# Altium schematic sheet 4-USB-A.SchDoc
size A4
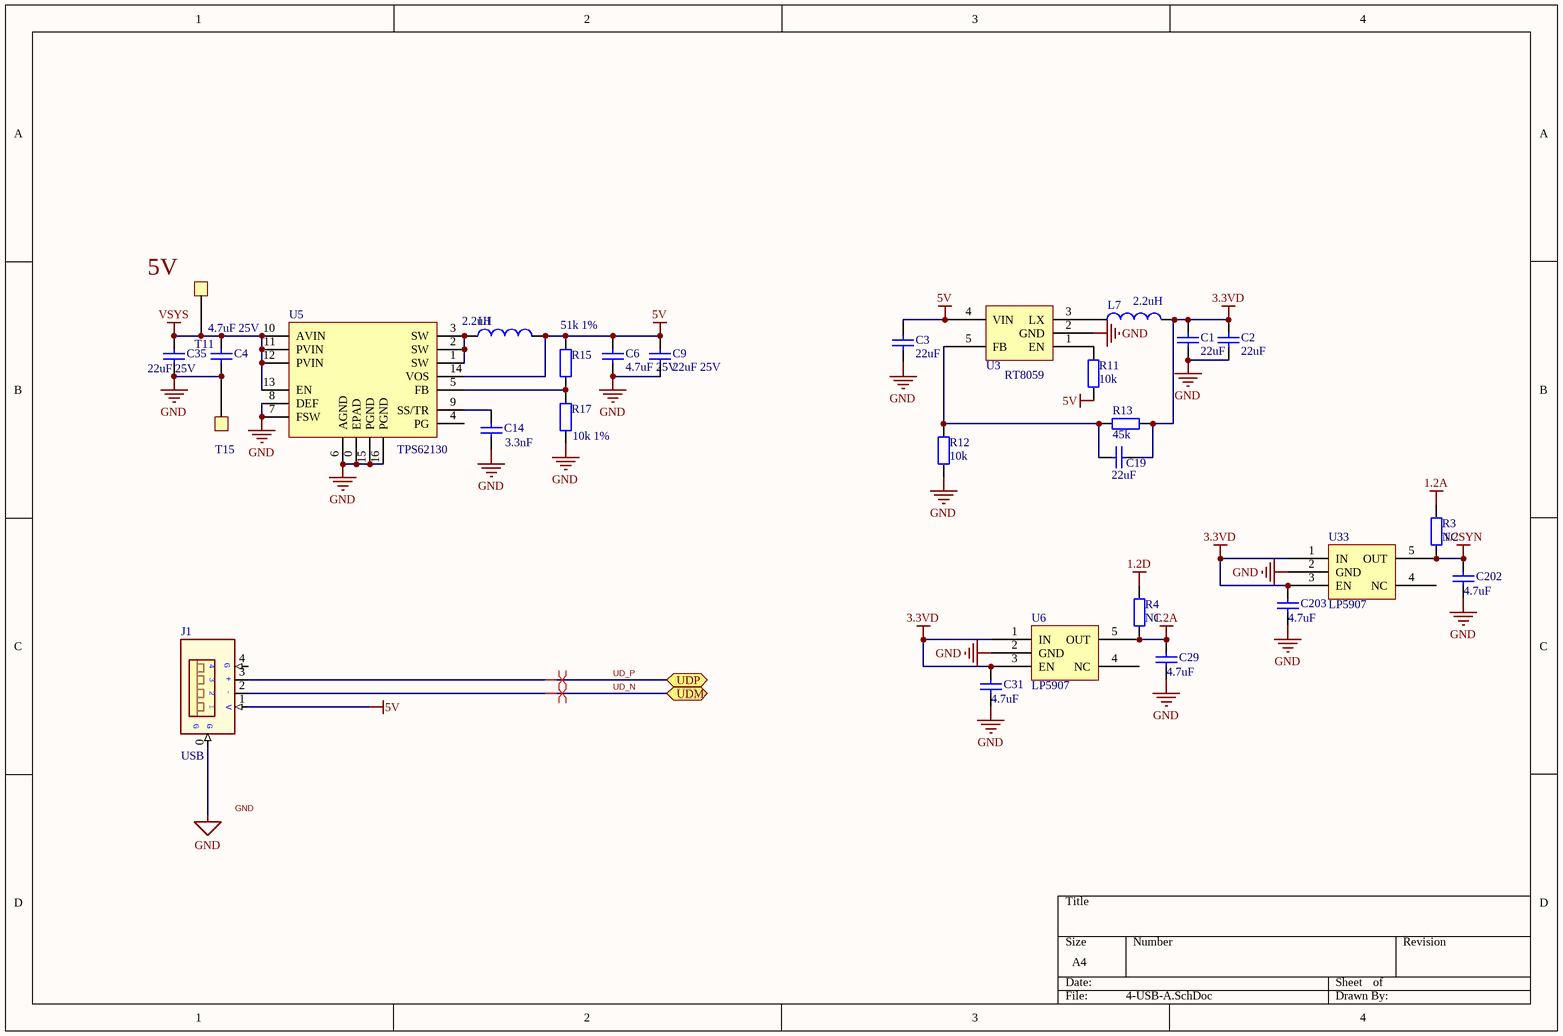
[diagram p0: 4-USB-A.SchDoc]

## Parts
C1  value 22uF  [0805]  (hidden comment: Cap)
C2  value 22uF  [0805]  (hidden comment: Cap)
C3  value 22uF  [0805]  (hidden comment: Cap)
C4  value 4.7uF 25V  [0805]  (hidden comment: Cap)
C6  value 4.7uF 25V  [0805]  (hidden comment: Cap)
C9  value 22uF 25V  [1210]  (hidden comment: Cap)
C14  3.3nF  [0402]
C19  value 22uF  [0402]  (hidden comment: Cap)
C29  4.7uF  [0603]
C31  4.7uF  [0603]
C35  value 22uF 25V  [1210]  (hidden comment: Cap)
C202  4.7uF  [0603]
C203  4.7uF  [0603]
J1  USB  [USB-A-MALE]
L1  2.2uH  [L4015]
L7  2.2uH  [0806]
R3  NC  [0402]
R4  NC  [0402]
R11  10k  [0402]
R12  10k  [0402]
R13  45k  [0402]
R15  51k 1%  [0402]
R17  10k 1%  [0402]
T11  TestPad  [TestPad]  (value not drawn)
T15  TestPad  [TestPad]  (value not drawn)
U3  RT8059  [SOT23-5]
U5  TPS62130  [TPS62130]
U6  LP5907  [SOT23-5]
U33  LP5907  [SOT23-5]

## Ports
UDM (bidir), UDP (bidir)

## Nets
1.2A: C29.2 R3.2 R4.1 U6.5(OUT)
1.2D: R4.2
1.2SYN: C202.2 R3.1 U33.5(OUT)
3.3VD: C1.2 C2.2 C19.1 C31.2 C203.2 L7.2 R13.2 U6.1(IN) U6.3(EN) U33.1(IN) U33.3(EN)
5V: C3.2 C6.2 C9.2 J1.1(V+) L1.2 R11.2 R15.1 U3.4(VIN) U5.14(VOS)
GND: C1.1 C2.1 C3.1 C4.2 C6.1 C9.1 C14.2 C29.1 C31.1 C35.2 C202.1 C203.1 J1.0(G) R12.1 R17.2 T15.1 U3.2(GND) U5.0(EPAD) U5.6(AGND) U5.7(FSW) U5.8(DEF) U5.15(PGND) U5.16(PGND) U6.2(GND) U33.2(GND)
VSYS: C4.1 C35.1 T11.1 U5.10(AVIN) U5.11(PVIN) U5.12(PVIN) U5.13(EN)
UD_N: J1.2(D-) ; port UDM
UD_P: J1.3(D+) ; port UDP
NetC14_1: C14.1 U5.9(SS/TR)
NetC19_2: C19.2 R12.2 R13.1 U3.5(FB)
NetL1_1: L1.1 U5.1(SW) U5.2(SW) U5.3(SW)
NetL7_1: L7.1 U3.3(LX)
NetR11_1: R11.1 U3.1(EN)
NetR15_2: R15.2 R17.1 U5.5(FB)

Not connected (* = marked no-connect by the designer): J1 4(G); U5 4(PG); U6 4(NC); U33 4(NC)

## Layout directives
differential pair: UD_N, UD_P

## Notes on the sheet
- (near T11) 5V
- Labels drawn without touching a wire or pin: GND
- (in symbol USB) +; -; V

## Library data of the parts
C1-C4 C6 C9 C14 C19 C29 C31 C35 C202 C203 = Cap: Capacitor; Published: 8-Jun-2000; LatestRevisionDate: 17-Jul-2002; LatestRevisionNote: Re-released for DXP Platform.; PackageReference: RAD-0.3; Publisher: Altium Limited; PackageDescription: Radial Cap, Thru-Hole; 2 Leads; 0.3 in Pin Spacing
L1 L7 = Inductor: Code_IEC: 1005; Published: 8-Jun-2000; LatestRevisionDate: 29-May-2009; LatestRevisionNote: IPC-7351 Footprint Added.; PackageReference: 0402-A; Publisher: Altium Limited; PackageDescription: Chip Inductor; Code_JEITA: 0402
R3 R4 R11-R13 R15 R17 = Res2: Resistor; Published: 8-Jun-2000; LatestRevisionDate: 17-Jul-2002; LatestRevisionNote: Re-released for DXP Platform.; PackageReference: AXIAL-0.4; Publisher: Altium Limited; PackageDescription: Axial Device, Thru-Hole; 2 Leads; 0.4 in Pin Spacing